# EAGLE design Encoder (EAGLE 9.1.0)
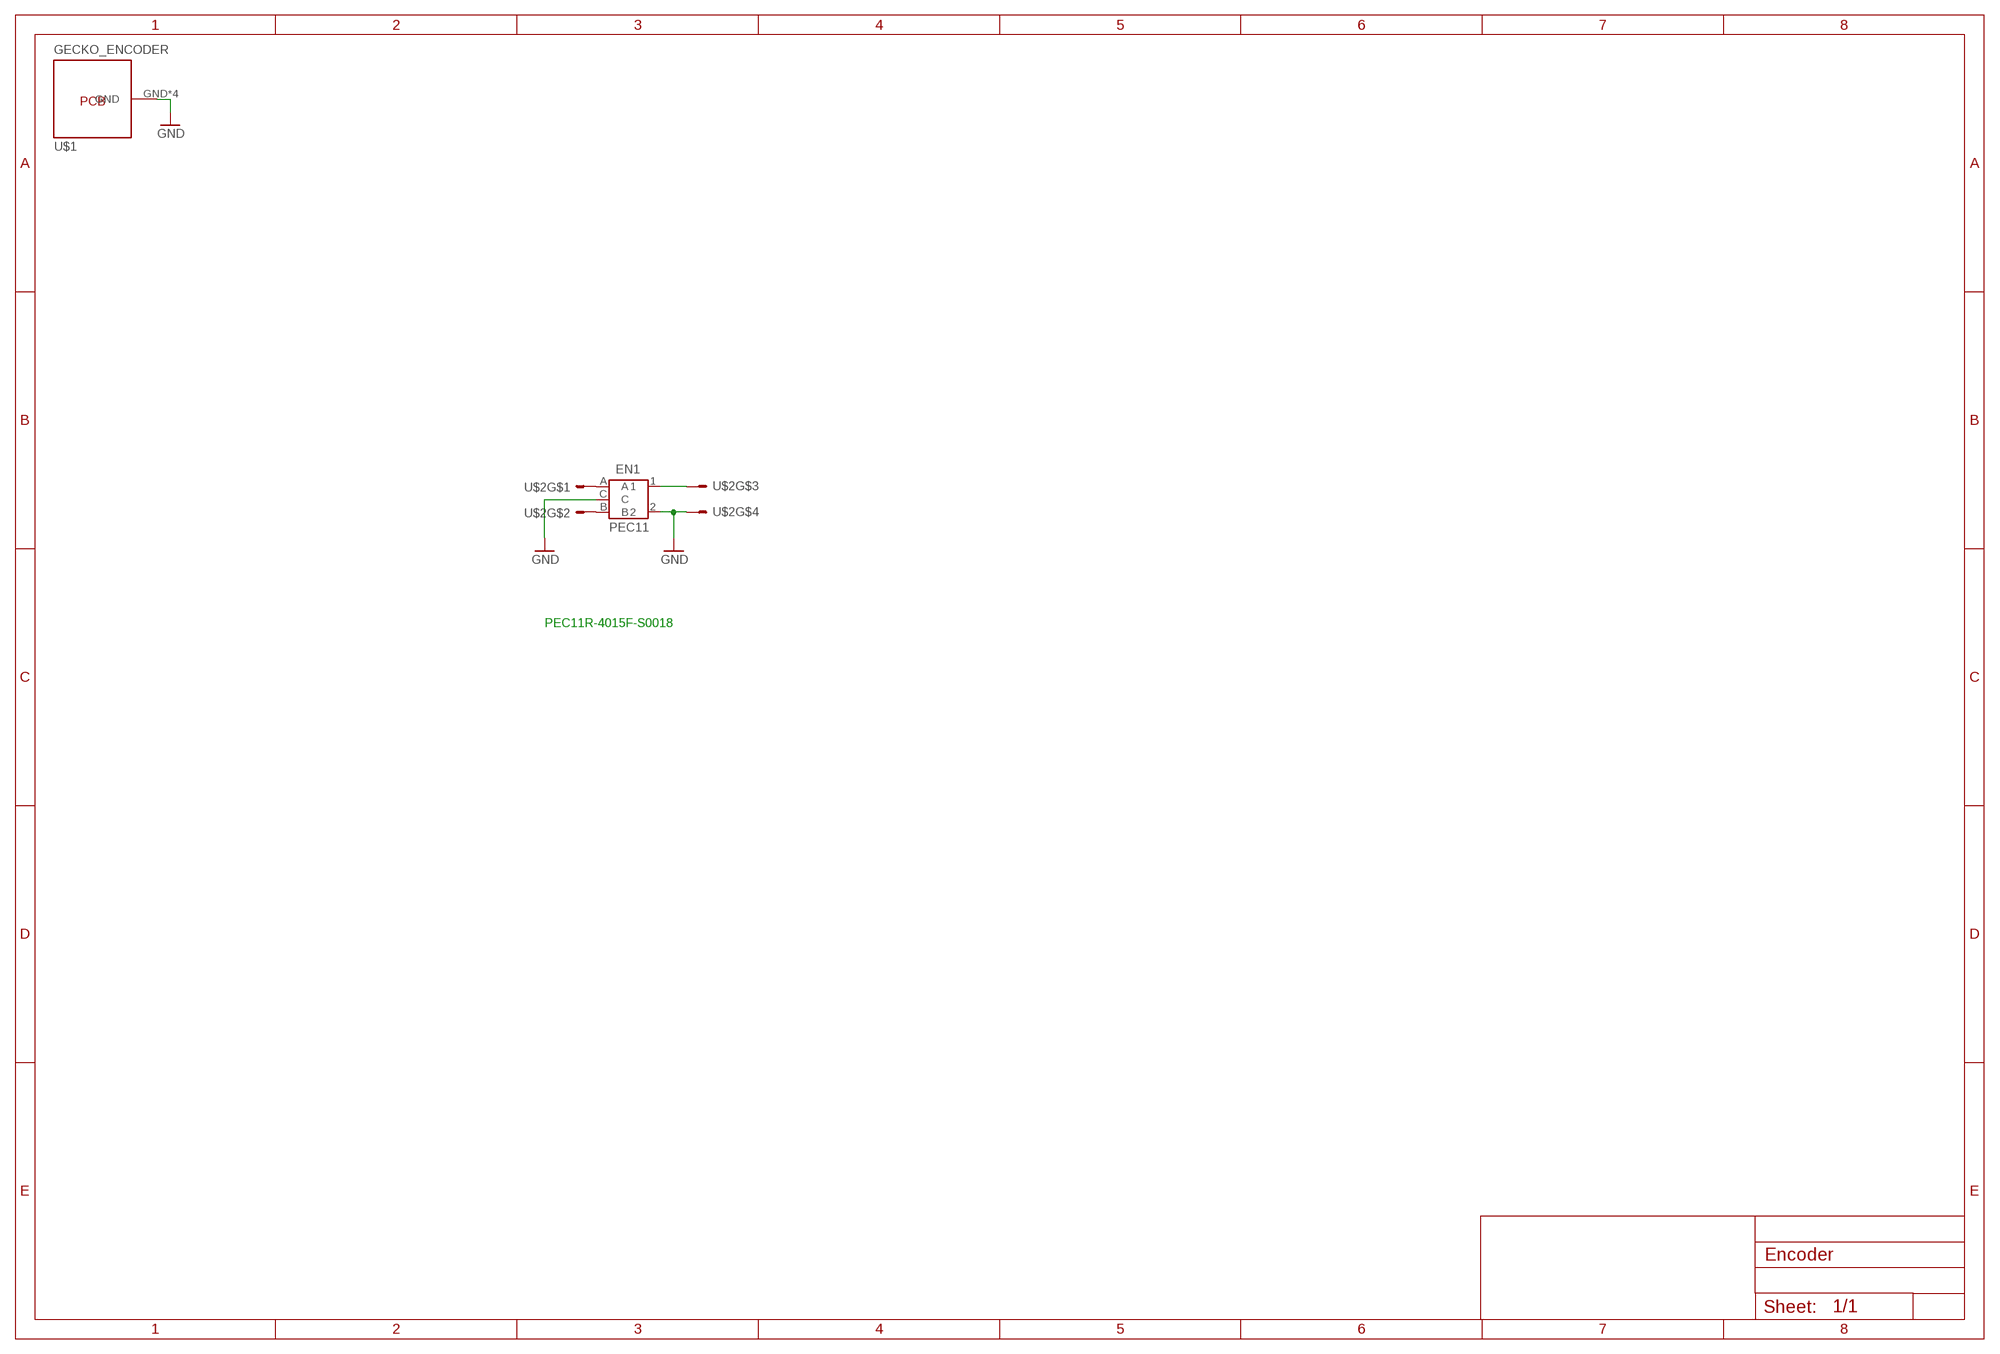
[diagram p0: schematic, sheet 1]

## Parts
EN1  PEC11  [PEC11_4XXXXK-S]
U$1  GECKO_ENCODER  [GECKO_ENCODER]
U$2  JST-SH-4-SMT  [JST-SH-4-SMT]

## Nets
GND: EN1.2 EN1.C U$1.GND U$1.GND1(GND) U$1.GND2(GND) U$1.GND3(GND) U$2.P$4
N$1: EN1.A U$2.P$1
N$2: EN1.B U$2.P$2
N$3: EN1.1 U$2.P$3

## Notes on the sheet
- PEC11R-4015F-S0018

## Library data of the parts
EN1 = bourns (1):PEC11
U$1 = MyLib:GECKO_ENCODER
U$2 = MyLib:JST-SH-4-SMT

## Board
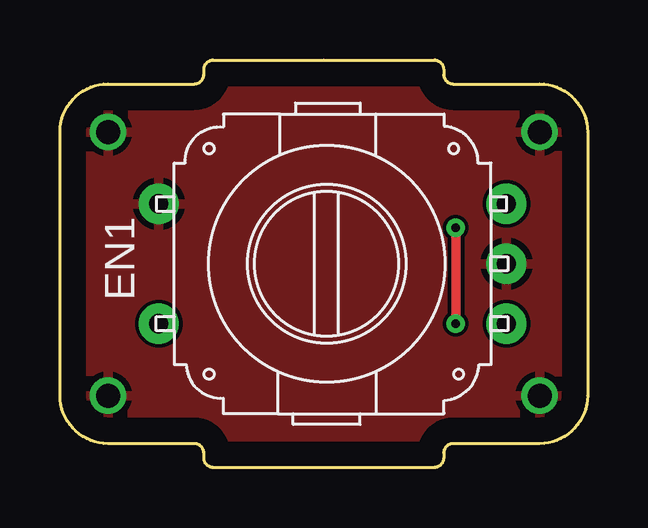
[diagram p1: board, top side]
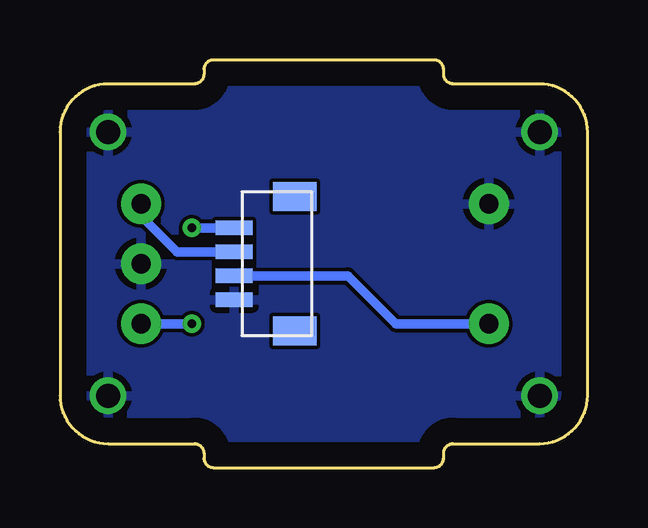
[diagram p2: board, bottom side, seen from below]

Size 22 x 17 mm. Coordinates in mm from the lower left corner, seen from the top.
Copper layers (1*16): Top 0.035mm / dielectric 1.5mm / Bottom 0.035mm
Design rules "default": minimum track width 6mil, minimum drill 0.35mm, track to track 6mil, track to pad 6mil, pad to pad 6mil, via to via 6mil, smd to smd 6mil, copper to edge 40mil, drill to drill 6mil, minimum pad ring 10mil, minimum via ring 8mil, stop-mask expansion 4mil, vias tented up to drill 0mil, thermal gap 10mil

### Footprints (pad centres in the part's own frame; a part is rotated, then mirrored left to right if it is on the bottom)
PEC11_4XXXXK-S = drill 0.8 pad 1.676: 1 -2.5,14.5; 2 2.5,14.5; A -2.5,0; B 2.5,0; C 0,0
GECKO_ENCODER = drill 1: GND -9,-5.5; GND1 -9,5.5; GND2 9,5.5; GND3 9,-5.5
JST-SH-4-SMT = smd 1.2 x 1.8: NC1 -2.8,2.1; NC2 2.8,2.1 | smd 0.6 x 1.55: P$1 -1.5,-0.425; P$2 -0.5,-0.425; P$3 0.5,-0.425; P$4 1.5,-0.425

### Placement (x,y rotation side)
EN1  18.62,8.5 90 top
U$1  11,8.5 0 top
U$2  14.31,8.5 270 bottom

### Tracks (layer width: path | path; a pad name or v marks a point on that pad's centre or on a via)
GND
  pour Top: -0.5,17.5 22.5,17.5 22.5,-0.5 -0.5,-0.5
  pour Bottom: -0.5,-0.5 22.5,-0.5 22.5,17.5 -0.5,17.5
N$1  (via drill 0.35)
  Top 0.4: v16.5,10 v16.5,6
  Bottom 0.4: U$2.P$1 v16.5,10 | v16.5,6 EN1.A
N$2
  Bottom 0.4: U$2.P$2 17.12,9 18.62,10.5 EN1.B
N$3
  Bottom 0.4: U$2.P$3 10,8 8,6 EN1.1